# Altium schematic sheet Cathode_Switch.SchDoc
size 594 x 420 mm; SheetNumber: 4; SheetTotal: 4
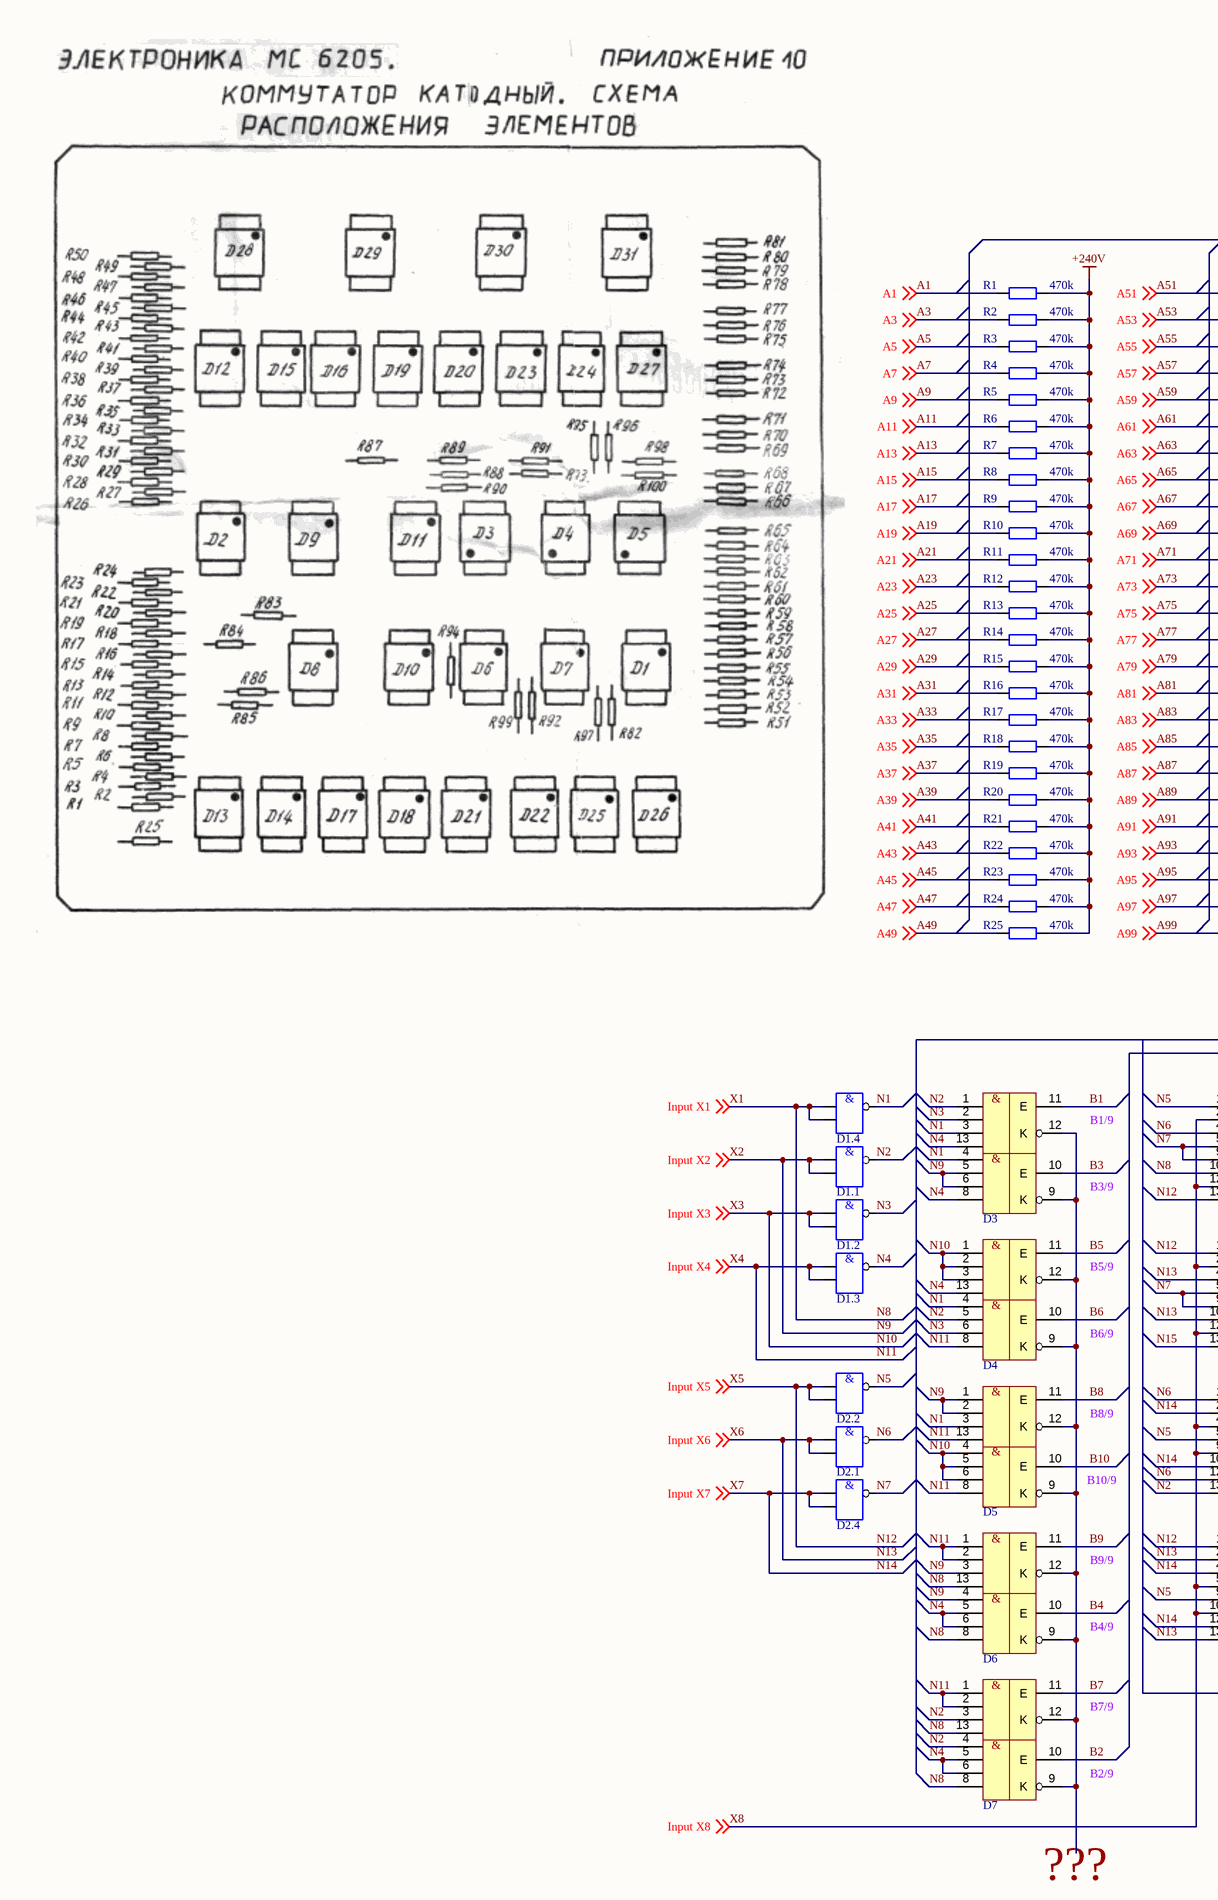
[diagram p0: Cathode_Switch.SchDoc, left]
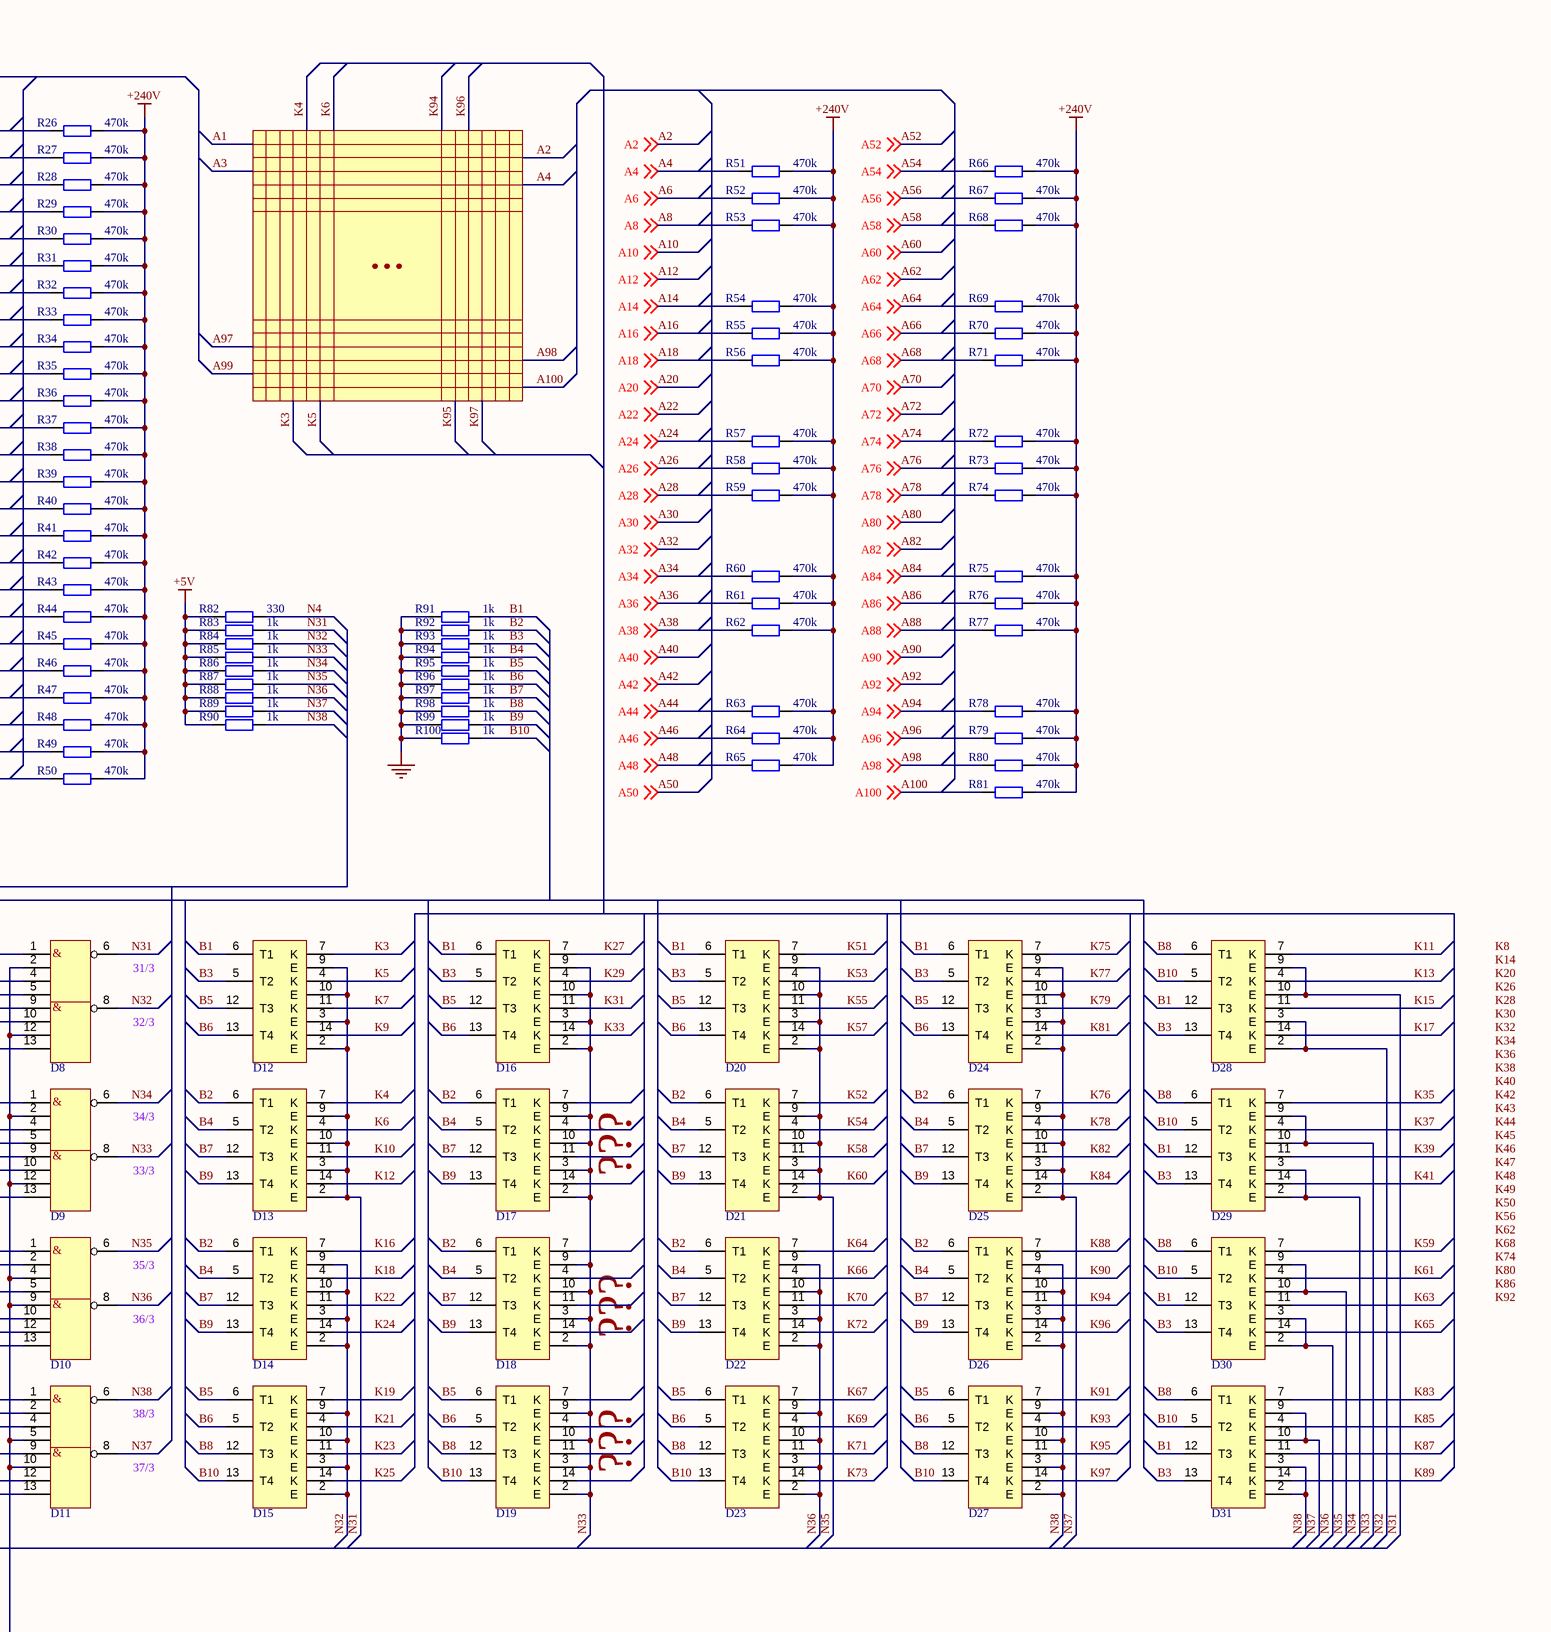
[diagram p1: Cathode_Switch.SchDoc, right]

## Parts
D1.1  -  (value not drawn)
D1.2  -  (value not drawn)
D1.3  -  (value not drawn)
D1.4  -  (value not drawn)
D2.1  -  (value not drawn)
D2.2  -  (value not drawn)
D2.4  -  (value not drawn)
D3  -  (value not drawn)
D4  -  (value not drawn)
D5  -  (value not drawn)
D6  -  (value not drawn)
D7  -  (value not drawn)
D8  -  (value not drawn)
D9  -  (value not drawn)
D10  -  (value not drawn)
D11  -  (value not drawn)
D12  -  (value not drawn)
D13  -  (value not drawn)
D14  -  (value not drawn)
D15  -  (value not drawn)
D16  -  (value not drawn)
D17  -  (value not drawn)
D18  -  (value not drawn)
D19  -  (value not drawn)
D20  -  (value not drawn)
D21  -  (value not drawn)
D22  -  (value not drawn)
D23  -  (value not drawn)
D24  -  (value not drawn)
D25  -  (value not drawn)
D26  -  (value not drawn)
D27  -  (value not drawn)
D28  -  (value not drawn)
D29  -  (value not drawn)
D30  -  (value not drawn)
D31  -  (value not drawn)
R1  470k
R2  470k
R3  470k
R4  470k
R5  470k
R6  470k
R7  470k
R8  470k
R9  470k
R10  470k
R11  470k
R12  470k
R13  470k
R14  470k
R15  470k
R16  470k
R17  470k
R18  470k
R19  470k
R20  470k
R21  470k
R22  470k
R23  470k
R24  470k
R25  470k
R26  470k
R27  470k
R28  470k
R29  470k
R30  470k
R31  470k
R32  470k
R33  470k
R34  470k
R35  470k
R36  470k
R37  470k
R38  470k
R39  470k
R40  470k
R41  470k
R42  470k
R43  470k
R44  470k
R45  470k
R46  470k
R47  470k
R48  470k
R49  470k
R50  470k
R51  470k
R52  470k
R53  470k
R54  470k
R55  470k
R56  470k
R57  470k
R58  470k
R59  470k
R60  470k
R61  470k
R62  470k
R63  470k
R64  470k
R65  470k
R66  470k
R67  470k
R68  470k
R69  470k
R70  470k
R71  470k
R72  470k
R73  470k
R74  470k
R75  470k
R76  470k
R77  470k
R78  470k
R79  470k
R80  470k
R81  470k
R82  330
R83  1k
R84  1k
R85  1k
R86  1k
R87  1k
R88  1k
R89  1k
R90  1k
R91  1k
R92  1k
R93  1k
R94  1k
R95  1k
R96  1k
R97  1k
R98  1k
R99  1k
R100  1k

## Nets
+5V: R82.2 R83.2 R84.2 R85.2 R86.2 R87.2 R88.2 R89.2 R90.2
+240V: R1.1 R2.1 R3.1 R4.1 R5.1 R6.1 R7.1 R8.1 R9.1 R10.1 R11.1 R12.1 R13.1 R14.1 R15.1 R16.1 R17.1 R18.1 R19.1 R20.1 R21.1 R22.1 R23.1 R24.1 R25.1 R26.1 R27.1 R28.1 R29.1 R30.1 R31.1 R32.1 R33.1 R34.1 R35.1 R36.1 R37.1 R38.1 R39.1 R40.1 R41.1 R42.1 R43.1 R44.1 R45.1 R46.1 R47.1 R48.1 R49.1 R50.1 R51.1 R52.1 R53.1 R54.1 R55.1 R56.1 R57.1 R58.1 R59.1 R60.1 R61.1 R62.1 R63.1 R64.1 R65.1 R66.1 R67.1 R68.1 R69.1 R70.1 R71.1 R72.1 R73.1 R74.1 R75.1 R76.1 R77.1 R78.1 R79.1 R80.1 R81.1
GND: R91.2 R92.2 R93.2 R94.2 R95.2 R96.2 R97.2 R98.2 R99.2 R100.2
A1: R1.2 ; off-sheet A1
A3: R2.2 ; off-sheet A3
A4: R51.2 ; off-sheet A4
A5: R3.2 ; off-sheet A5
A6: R52.2 ; off-sheet A6
A7: R4.2 ; off-sheet A7
A8: R53.2 ; off-sheet A8
A9: R5.2 ; off-sheet A9
A11: R6.2 ; off-sheet A11
A13: R7.2 ; off-sheet A13
A14: R54.2 ; off-sheet A14
A15: R8.2 ; off-sheet A15
A16: R55.2 ; off-sheet A16
A17: R9.2 ; off-sheet A17
A18: R56.2 ; off-sheet A18
A19: R10.2 ; off-sheet A19
A21: R11.2 ; off-sheet A21
A23: R12.2 ; off-sheet A23
A24: R57.2 ; off-sheet A24
A25: R13.2 ; off-sheet A25
A26: R58.2 ; off-sheet A26
A27: R14.2 ; off-sheet A27
A28: R59.2 ; off-sheet A28
A29: R15.2 ; off-sheet A29
A31: R16.2 ; off-sheet A31
A33: R17.2 ; off-sheet A33
A34: R60.2 ; off-sheet A34
A35: R18.2 ; off-sheet A35
A36: R61.2 ; off-sheet A36
A37: R19.2 ; off-sheet A37
A38: R62.2 ; off-sheet A38
A39: R20.2 ; off-sheet A39
A41: R21.2 ; off-sheet A41
A43: R22.2 ; off-sheet A43
A44: R63.2 ; off-sheet A44
A45: R23.2 ; off-sheet A45
A46: R64.2 ; off-sheet A46
A47: R24.2 ; off-sheet A47
A48: R65.2 ; off-sheet A48
A49: R25.2 ; off-sheet A49
A51: R26.2 ; off-sheet A51
A53: R27.2 ; off-sheet A53
A54: R66.2 ; off-sheet A54
A55: R28.2 ; off-sheet A55
A56: R67.2 ; off-sheet A56
A57: R29.2 ; off-sheet A57
A58: R68.2 ; off-sheet A58
A59: R30.2 ; off-sheet A59
A61: R31.2 ; off-sheet A61
A63: R32.2 ; off-sheet A63
A64: R69.2 ; off-sheet A64
A65: R33.2 ; off-sheet A65
A66: R70.2 ; off-sheet A66
A67: R34.2 ; off-sheet A67
A68: R71.2 ; off-sheet A68
A69: R35.2 ; off-sheet A69
A71: R36.2 ; off-sheet A71
A73: R37.2 ; off-sheet A73
A74: R72.2 ; off-sheet A74
A75: R38.2 ; off-sheet A75
A76: R73.2 ; off-sheet A76
A77: R39.2 ; off-sheet A77
A78: R74.2 ; off-sheet A78
A79: R40.2 ; off-sheet A79
A81: R41.2 ; off-sheet A81
A83: R42.2 ; off-sheet A83
A84: R75.2 ; off-sheet A84
A85: R43.2 ; off-sheet A85
A86: R76.2 ; off-sheet A86
A87: R44.2 ; off-sheet A87
A88: R77.2 ; off-sheet A88
A89: R45.2 ; off-sheet A89
A91: R46.2 ; off-sheet A91
A93: R47.2 ; off-sheet A93
A94: R78.2 ; off-sheet A94
A95: R48.2 ; off-sheet A95
A96: R79.2 ; off-sheet A96
A97: R49.2 ; off-sheet A97
A98: R80.2 ; off-sheet A98
A99: R50.2 ; off-sheet A99
A100: R81.2 ; off-sheet A100
B1: D3.11(E) D12.6(T1) D16.6(T1) D20.6(T1) D24.6(T1) D28.12(T3) D29.12(T3) D30.12(T3) D31.12(T3) R91.1
B2: D7.10(E) D13.6(T1) D14.6(T1) D17.6(T1) D18.6(T1) D21.6(T1) D22.6(T1) D25.6(T1) D26.6(T1) R92.1
B3: D3.10(E) D12.5(T2) D16.5(T2) D20.5(T2) D24.5(T2) D28.13(T4) D29.13(T4) D30.13(T4) D31.13(T4) R93.1
B4: D6.10(E) D13.5(T2) D14.5(T2) D17.5(T2) D18.5(T2) D21.5(T2) D22.5(T2) D25.5(T2) D26.5(T2) R94.1
B5: D4.11(E) D12.12(T3) D15.6(T1) D16.12(T3) D19.6(T1) D20.12(T3) D23.6(T1) D24.12(T3) D27.6(T1) R95.1
B6: D4.10(E) D12.13(T4) D15.5(T2) D16.13(T4) D19.5(T2) D20.13(T4) D23.5(T2) D24.13(T4) D27.5(T2) R96.1
B7: D7.11(E) D13.12(T3) D14.12(T3) D17.12(T3) D18.12(T3) D21.12(T3) D22.12(T3) D25.12(T3) D26.12(T3) R97.1
B8: D5.11(E) D15.12(T3) D19.12(T3) D23.12(T3) D27.12(T3) D28.6(T1) D29.6(T1) D30.6(T1) D31.6(T1) R98.1
B9: D6.11(E) D13.13(T4) D14.13(T4) D17.13(T4) D18.13(T4) D21.13(T4) D22.13(T4) D25.13(T4) D26.13(T4) R99.1
B10: D5.10(E) D15.13(T4) D19.13(T4) D23.13(T4) D27.13(T4) D28.5(T2) D29.5(T2) D30.5(T2) D31.5(T2) R100.1
K3: D12.7(K)
K4: D13.7(K)
K5: D12.4(K)
K6: D13.4(K)
K7: D12.11(K)
K9: D12.14(K)
K10: D13.11(K)
K11: D28.7(K)
K12: D13.14(K)
K13: D28.4(K)
K15: D28.11(K)
K16: D14.7(K)
K17: D28.14(K)
K18: D14.4(K)
K19: D15.7(K)
K21: D15.4(K)
K22: D14.11(K)
K23: D15.11(K)
K24: D14.14(K)
K25: D15.14(K)
K27: D16.7(K)
K29: D16.4(K)
K31: D16.11(K)
K33: D16.14(K)
K35: D29.7(K)
K37: D29.4(K)
K39: D29.11(K)
K41: D29.14(K)
K51: D20.7(K)
K52: D21.7(K)
K53: D20.4(K)
K54: D21.4(K)
K55: D20.11(K)
K57: D20.14(K)
K58: D21.11(K)
K59: D30.7(K)
K60: D21.14(K)
K61: D30.4(K)
K63: D30.11(K)
K64: D22.7(K)
K65: D30.14(K)
K66: D22.4(K)
K67: D23.7(K)
K69: D23.4(K)
K70: D22.11(K)
K71: D23.11(K)
K72: D22.14(K)
K73: D23.14(K)
K75: D24.7(K)
K76: D25.7(K)
K77: D24.4(K)
K78: D25.4(K)
K79: D24.11(K)
K81: D24.14(K)
K82: D25.11(K)
K83: D31.7(K)
K84: D25.14(K)
K85: D31.4(K)
K87: D31.11(K)
K88: D26.7(K)
K89: D31.14(K)
K90: D26.4(K)
K91: D27.7(K)
K93: D27.4(K)
K94: D26.11(K)
K95: D27.11(K)
K96: D26.14(K)
K97: D27.14(K)
N1: D1.4.3 D3.3(X3) D3.4(X5) D4.4(X5) D5.3(X3)
N2: D1.1.3 D3.1(X1) D4.5(X6) D7.3(X3) D7.4(X5) D10.13(X8)
N3: D1.2.3 D3.2(X2) D4.6(X7)
N4: D1.3.3 D3.8(X8) D3.13(X4) D4.13(X4) D6.5(X6) D6.6(X7) D7.5(X6) D7.6(X7) R82.1
N5: D2.2.3 D8.1(X1) D10.5(X4) D11.9(X5)
N6: D2.1.3 D8.4(X3) D10.1(X1) D10.12(X7)
N7: D2.4.3 D8.5(X4) D8.9(X5) D9.5(X4) D9.9(X5)
N8: D1.4.1 D1.4.2 D6.8(X8) D6.13(X4) D7.8(X8) D7.13(X4) D8.10(X6) ; off-sheet Input X1  [also labelled Input X1, X1]
N9: D1.1.1 D1.1.2 D3.5(X6) D3.6(X7) D5.1(X1) D5.2(X2) D6.3(X3) D6.4(X5) ; off-sheet Input X2  [also labelled Input X2, X2]
N10: D1.2.1 D1.2.2 D4.1(X1) D4.2(X2) D4.3(X3) D5.4(X5) D5.5(X6) D5.6(X7) ; off-sheet Input X3  [also labelled Input X3, X3]
N11: D1.3.1 D1.3.2 D4.8(X8) D5.8(X8) D5.13(X4) D6.1(X1) D6.2(X2) D7.1(X1) D7.2(X2) ; off-sheet Input X4  [also labelled Input X4, X4]
N12: D2.2.1 D2.2.2 D8.13(X8) D9.1(X1) D11.1(X1) ; off-sheet Input X5  [also labelled Input X5, X5]
N13: D2.1.1 D2.1.2 D9.4(X3) D9.10(X6) D11.2(X2) D11.13(X8) ; off-sheet Input X6  [also labelled Input X6, X6]
N14: D2.4.1 D2.4.2 D10.2(X2) D10.10(X6) D11.4(X3) D11.12(X7) ; off-sheet Input X7  [also labelled Input X7, X7]
N15: D9.13(X8)
N31: D8.6(Y1) D12.2(E) D12.3(E) D12.9(E) D12.10(E) D13.2(E) D13.3(E) D13.9(E) D13.10(E) D28.9(E) D28.10(E) R83.1
N32: D8.8(Y2) D14.2(E) D14.3(E) D14.9(E) D14.10(E) D15.2(E) D15.3(E) D15.9(E) D15.10(E) D28.2(E) D28.3(E) R84.1
N33: D9.8(Y2) D16.2(E) D16.3(E) D16.9(E) D16.10(E) D17.2(E) D17.3(E) D17.9(E) D17.10(E) D18.2(E) D18.3(E) D18.9(E) D18.10(E) D19.2(E) D19.3(E) D19.9(E) D19.10(E) D29.9(E) D29.10(E) R85.1
N34: D9.6(Y1) D29.2(E) D29.3(E) R86.1
N35: D10.6(Y1) D20.2(E) D20.3(E) D20.9(E) D20.10(E) D21.2(E) D21.3(E) D21.9(E) D21.10(E) D30.9(E) D30.10(E) R87.1
N36: D10.8(Y2) D22.2(E) D22.3(E) D22.9(E) D22.10(E) D23.2(E) D23.3(E) D23.9(E) D23.10(E) D30.2(E) D30.3(E) R88.1
N37: D11.8(Y2) D24.2(E) D24.3(E) D24.9(E) D24.10(E) D25.2(E) D25.3(E) D25.9(E) D25.10(E) D31.9(E) D31.10(E) R89.1
N38: D11.6(Y1) D26.2(E) D26.3(E) D26.9(E) D26.10(E) D27.2(E) D27.3(E) D27.9(E) D27.10(E) D31.2(E) D31.3(E) R90.1
X8: D8.2(X2) D8.12(X7) D9.2(X2) D9.12(X7) D10.4(X3) D10.9(X5) D11.5(X4) D11.10(X6) ; off-sheet Input X8  [also labelled Input X8]
NetD3_9: D3.9(K) D3.12(K) D4.9(K) D4.12(K) D5.9(K) D5.12(K) D6.9(K) D6.12(K) D7.9(K) D7.12(K)

Not connected (* = marked no-connect by the designer): D17 4(K) 7(K) 11(K) 14(K); D18 4(K) 7(K) 11(K) 14(K); D19 4(K) 7(K) 11(K) 14(K)

## Notes on the sheet
- ...
- B1/9
- (near D8) 31/3
- B3/9
- (near D8) 32/3
- B5/9
- (near D9) 34/3
- (near D9) 33/3
- (near D17) ???
- B6/9
- B8/9
- (near D10) 35/3
- (near D18) ???
- B10/9
- (near D10) 36/3
- B9/9
- (near D11) 38/3
- (near D19) ???
- B4/9
- (near D11) 37/3
- B7/9
- B2/9
- (near D7) ???
- Labels drawn without touching a wire or pin: K8, K14, K20, K26, K28, K30, K32, K34, K36, K38, K40, K42, K43, K44, K45, K46, K47, K48, K49, K50, K56, K62, K68, K74, K80, K86, K92
- DWG NO:
- REV:
- REVISION
- DESCRIPTION
- DATE
- APPROVED
- ENG:
- APPROVALS
- PROJECT
- DSN:
- CHK:
- REFERENCE DOCUMENTS
- PROJECT REVISION:
- TITLE
- DOCUMENT REVISION:
- DESIGN ITEM:
- BOM:
- FAB DWG:
- PCB DWG:
- ASSY DWG:
- SCALE:
- A2
- SIZE
- CAGE CODE
- FILE NAME
- DWG NO.
- SHEET
- OF
- REV
- (in symbol NAND) &
- (in symbol К133ЛА7) &
- (in symbol К133ЛД1) &

## Library data of the parts
D1.1-D1.4 D2.1 D2.2 D2.4 = NAND
D3-D7 = К133ЛД1
D8-D11 = К133ЛА7
D12-D31 = Transistor_Matrix
R1-R100 = R